# Altium schematic sheet pay-motors-prototype.SchDoc
size A4; DrawnBy: Lorna Lan; DocumentNumber: 1; Revision: V1; SheetNumber: 1; SheetTotal: 7
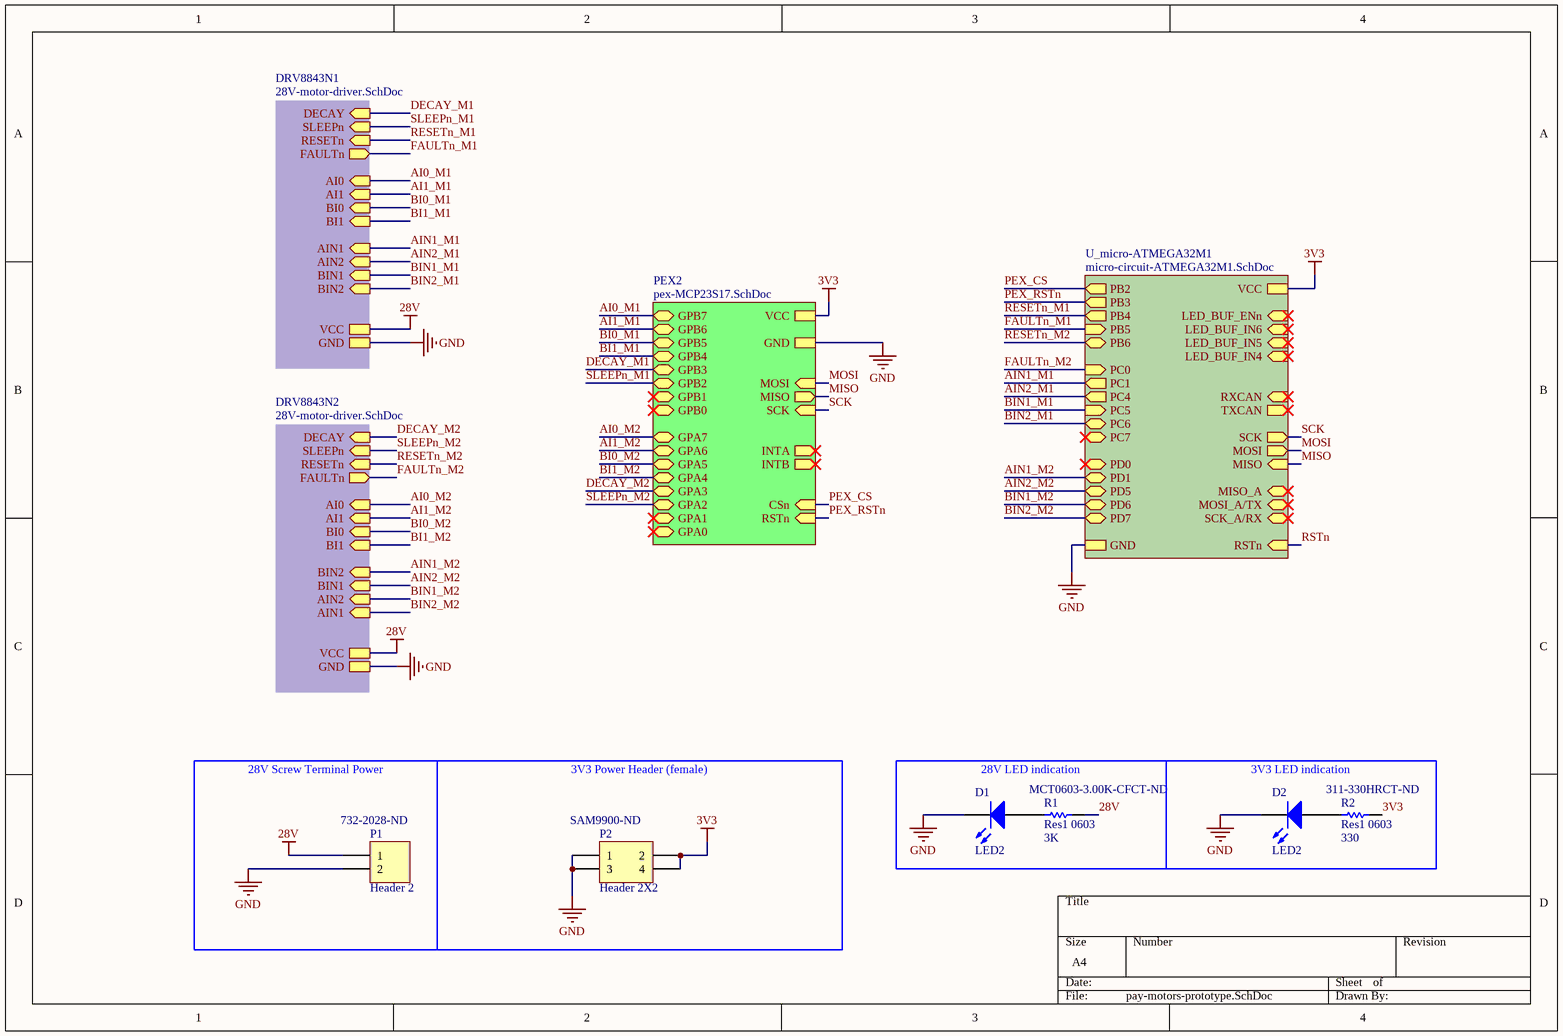
[diagram p0: pay-motors-prototype.SchDoc]

## Parts
D1  LED2  [0603-LED]
D2  LED2  [0603-LED]
P1  Header 2  Supplier Part Number 1: 732-2028-ND  [CON2_SCREW_5.00MM_691102710002]
P2  Header 2X2  Supplier Part Number 1: SAM9900-ND  [HDR2X2]
R1  Res1 0603  value 3K  Supplier Part Number 1: MCT0603-3.00K-CFCT-ND  [0603-RES]
R2  Res1 0603  value 330  Supplier Part Number 1: 311-330HRCT-ND  [0603-RES]

## Sub-sheets
DRV8843N1 = 28V-motor-driver.SchDoc: DECAY (in), GND, SLEEPn (in), BI1 (in), BI0 (in), RESETn (in), VCC, FAULTn (out), AI1 (in), AI0 (in), BIN2 (in), BIN1 (in), AIN2 (in), AIN1 (in)
DRV8843N2 = 28V-motor-driver.SchDoc: DECAY (in), GND, SLEEPn (in), BI1 (in), BI0 (in), RESETn (in), VCC, FAULTn (out), AI1 (in), AI0 (in), BIN2 (in), BIN1 (in), AIN2 (in), AIN1 (in)
PEX2 = pex-MCP23S17.SchDoc: RSTn (in), GPA0 (bidir), GPA6 (bidir), GPA1 (bidir), GPB2 (bidir), INTB (out), GPB1 (bidir), GPB3 (bidir), GPA5 (bidir), GND, GPA7 (bidir), GPB7 (bidir), MISO (out), GPB4 (bidir), INTA (out), GPB6 (bidir), GPA2 (bidir), VCC, GPA3 (bidir), GPB0 (bidir), MOSI (in), SCK (in), GPA4 (bidir), GPB5 (bidir), CSn (in)
U_micro-ATMEGA32M1 = micro-circuit-ATMEGA32M1.SchDoc: LED_BUF_IN6 (in), LED_BUF_IN5 (in), LED_BUF_IN4 (in), LED_BUF_ENn (in), PB5 (in), MOSI_A/TX (bidir), PB2 (out), MISO_A (bidir), RXCAN (in), TXCAN (out), PC0 (in), PB3 (out), PC1 (out), PC4 (out), PC5 (in), PC6 (bidir), PC7 (bidir), PD1 (bidir), PD5 (bidir), PD6 (bidir), PD7 (bidir), PD0 (bidir), PB4 (out), SCK (out), SCK_A/RX (bidir), MISO (in), MOSI (out), PB6 (bidir), RSTn (in), GND, VCC

## Nets
3V3: P2.2 P2.4 R2.2 ; sheet U_micro-ATMEGA32M1/VCC, sheet PEX2/VCC
28V: P1.1 R1.2 ; sheet DRV8843N1/VCC, sheet DRV8843N2/VCC
GND: D1.2(K) D2.2(K) P1.2 P2.1 P2.3 ; sheet U_micro-ATMEGA32M1/GND, sheet PEX2/GND, sheet DRV8843N1/GND, sheet DRV8843N2/GND
AI0_M1: sheet PEX2/GPB7, sheet DRV8843N1/AI0
AI0_M2: sheet PEX2/GPA7, sheet DRV8843N2/AI0
AI1_M1: sheet PEX2/GPB6, sheet DRV8843N1/AI1
AI1_M2: sheet PEX2/GPA6, sheet DRV8843N2/AI1
AIN1_M1: sheet U_micro-ATMEGA32M1/PC1, sheet DRV8843N1/AIN1
AIN1_M2: sheet U_micro-ATMEGA32M1/PD1, sheet DRV8843N2/BIN2
AIN2_M1: sheet U_micro-ATMEGA32M1/PC4, sheet DRV8843N1/AIN2
AIN2_M2: sheet U_micro-ATMEGA32M1/PD5, sheet DRV8843N2/BIN1
BI0_M1: sheet PEX2/GPB5, sheet DRV8843N1/BI0
BI0_M2: sheet PEX2/GPA5, sheet DRV8843N2/BI0
BI1_M1: sheet PEX2/GPB4, sheet DRV8843N1/BI1
BI1_M2: sheet PEX2/GPA4, sheet DRV8843N2/BI1
BIN1_M1: sheet U_micro-ATMEGA32M1/PC5, sheet DRV8843N1/BIN1
BIN1_M2: sheet U_micro-ATMEGA32M1/PD6, sheet DRV8843N2/AIN2
BIN2_M1: sheet U_micro-ATMEGA32M1/PC6, sheet DRV8843N1/BIN2
BIN2_M2: sheet U_micro-ATMEGA32M1/PD7, sheet DRV8843N2/AIN1
DECAY_M1: sheet PEX2/GPB3, sheet DRV8843N1/DECAY
DECAY_M2: sheet PEX2/GPA3, sheet DRV8843N2/DECAY
FAULTn_M1: sheet U_micro-ATMEGA32M1/PB5, sheet DRV8843N1/FAULTn
FAULTn_M2: sheet U_micro-ATMEGA32M1/PC0, sheet DRV8843N2/FAULTn
MISO: sheet U_micro-ATMEGA32M1/MISO, sheet PEX2/MISO
MOSI: sheet U_micro-ATMEGA32M1/MOSI, sheet PEX2/MOSI
PEX_CS: sheet U_micro-ATMEGA32M1/PB2, sheet PEX2/CSn
PEX_RSTn: sheet U_micro-ATMEGA32M1/PB3, sheet PEX2/RSTn
RESETn_M1: sheet U_micro-ATMEGA32M1/PB4, sheet DRV8843N1/RESETn
RESETn_M2: sheet U_micro-ATMEGA32M1/PB6, sheet DRV8843N2/RESETn
RSTn: sheet U_micro-ATMEGA32M1/RSTn
SCK: sheet U_micro-ATMEGA32M1/SCK, sheet PEX2/SCK
SLEEPn_M1: sheet PEX2/GPB2, sheet DRV8843N1/SLEEPn
SLEEPn_M2: sheet PEX2/GPA2, sheet DRV8843N2/SLEEPn
NetD1_1: D1.1(A) R1.1
NetD2_1: D2.1(A) R2.1

## Notes on the sheet
- 28V LED indication
- 3V3 LED indication
- (near P1) 28V Screw Terminal Power
- (near P2) 3V3 Power Header (female)

## Library data of the parts
D1 D2 = LED2: Typical RED, GREEN, YELLOW, AMBER GaAs LED; Published: 8-Jun-2000; LatestRevisionDate: 17-Jul-2002; LatestRevisionNote: Re-released for DXP Platform.; PackageVersion: Feb-2002; PackageReference: 3.2X1.6X1.1; Publisher: Altium Limited; PackageDescription: SM LED; 2 Flat Leads
P1 = Header 2: Header, 2-Pin; LatestRevisionDate: 17-Jul-2002; LatestRevisionNote: Re-released for DXP Platform.; Publisher: Altium Limited; Supplier 1: Digi-Key
P2 = Header 2X2: Header, 2-Pin, Dual row; LatestRevisionDate: 17-Jul-2002; LatestRevisionNote: Re-released for DXP Platform.; Publisher: Altium Limited; Supplier 1: Digi-Key
R1 R2 = Res1: Resistor; Published: 8-Jun-2000; LatestRevisionDate: 17-Jul-2002; LatestRevisionNote: Re-released for DXP Platform.; Publisher: Altium Limited; Supplier 1: Digi-Key
  R2: PackageReference: AXIAL-0.3; PackageDescription: Axial Device, Thru-Hole; 2 Leads; 0.3 in Pin Spacing; ComponentLink1Description: Digikey Link; ComponentLink1URL: https://www.digikey.ca/product-detail/en/yageo/RC0603FR-07330RL/311-330HRCT-ND/730109